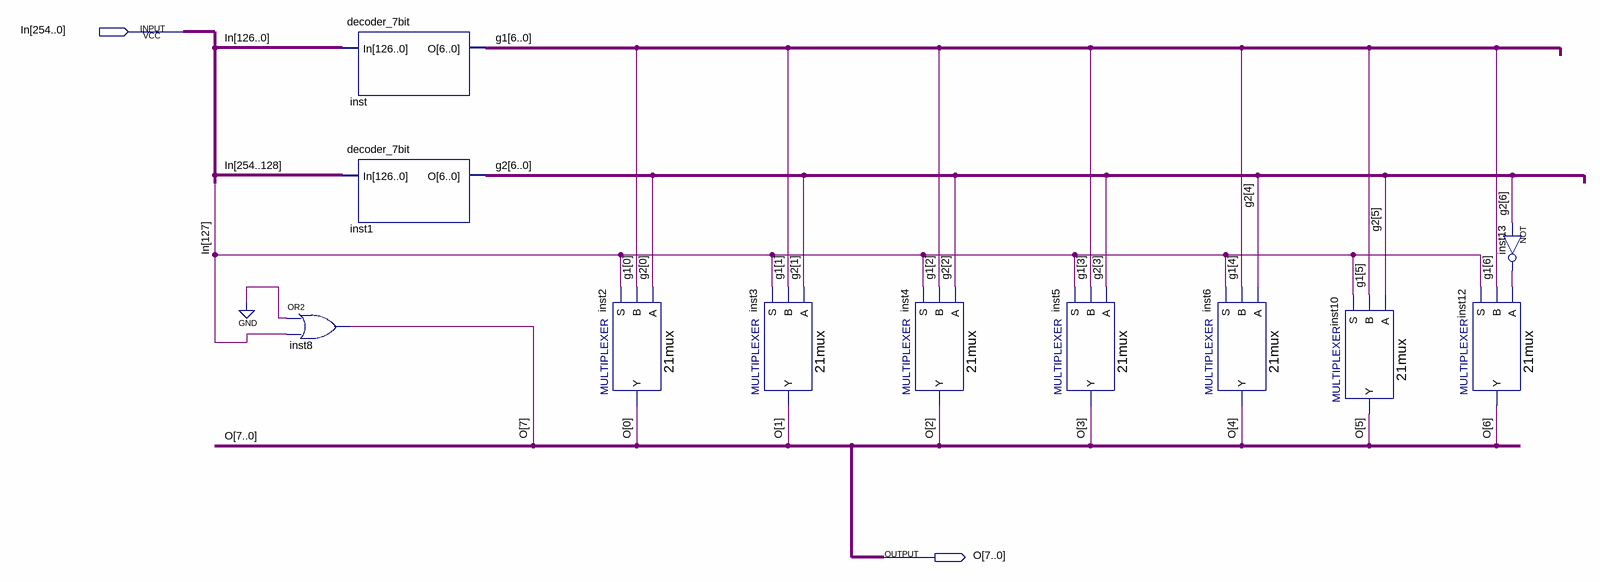
[diagram p0: schematic sheet]
// Quartus schematic decoder_8bit.bdf as structural Verilog: 11 symbols, 2 pins
module decoder_8bit (
  input  [254:0] In,
  output [7:0] O
);

  wire inst13_out;
  wire [6:0] g1, g2;

  or inst8 (O[7], 1'b0, In[127]);
  decoder_7bit inst (.In(In[126:0]), .O(g1));
  decoder_7bit inst1 (.In(In[254:128]), .O(g2));
  \21mux  inst2 (.S(In[127]), .B(g1[0]), .A(g2[0]), .Y(O[0]));
  \21mux  inst3 (.S(In[127]), .B(g1[1]), .A(g2[1]), .Y(O[1]));
  \21mux  inst4 (.S(In[127]), .B(g1[2]), .A(g2[2]), .Y(O[2]));
  \21mux  inst5 (.S(In[127]), .B(g1[3]), .A(g2[3]), .Y(O[3]));
  \21mux  inst6 (.S(In[127]), .B(g1[4]), .A(g2[4]), .Y(O[4]));
  \21mux  inst10 (.S(In[127]), .B(g1[5]), .A(g2[5]), .Y(O[5]));
  not inst13 (inst13_out, g2[6]);
  \21mux  inst12 (.S(In[127]), .B(g1[6]), .A(inst13_out), .Y(O[6]));
endmodule
